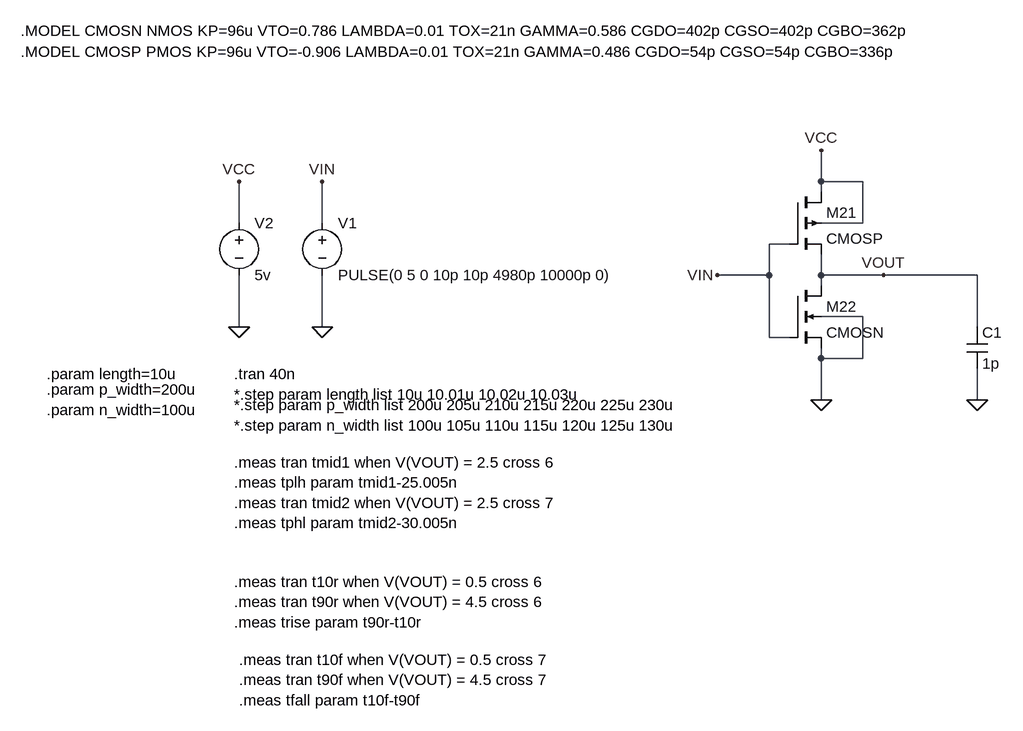
[diagram p0: schematic CMOS inverter with Overlap Capacitance.asc]
CMOS inverter with Overlap Capacitance.asc, the LTspice schematic file:
Version 4
SHEET 1 2240 1476
WIRE 688 96 688 48
WIRE 752 96 688 96
WIRE 688 112 688 96
WIRE -208 160 -208 96
WIRE -80 160 -80 96
WIRE 752 160 752 96
WIRE 752 160 688 160
WIRE 640 192 608 192
WIRE 608 240 608 192
WIRE 608 240 528 240
WIRE 688 240 688 208
WIRE 784 240 688 240
WIRE 928 240 784 240
WIRE 688 256 688 240
WIRE 752 304 688 304
WIRE -208 320 -208 240
WIRE -80 320 -80 240
WIRE 928 320 928 240
WIRE 608 336 608 240
WIRE 640 336 608 336
WIRE 688 368 688 352
WIRE 752 368 752 304
WIRE 752 368 688 368
WIRE 688 432 688 368
WIRE 928 432 928 384
FLAG -80 320 0
FLAG -80 96 VIN
FLAG -208 320 0
FLAG -208 96 VCC
FLAG 688 432 0
FLAG 688 48 VCC
FLAG 528 240 VIN
FLAG 784 240 VOUT
FLAG 928 432 0
SYMBOL voltage -80 144 R0
WINDOW 123 0 0 Left 0
WINDOW 39 0 0 Left 0
SYMATTR InstName V1
SYMATTR Value PULSE(0 5 0 10p 10p 4980p 10000p 0)
SYMBOL voltage -208 144 R0
WINDOW 123 0 0 Left 0
WINDOW 39 0 0 Left 0
SYMATTR InstName V2
SYMATTR Value 5v
SYMBOL pmos4 640 112 R0
SYMATTR InstName M21
SYMATTR Value CMOSP
SYMATTR Value2 l=length w=p_width
SYMBOL nmos4 640 256 R0
SYMATTR InstName M22
SYMATTR Value CMOSN
SYMATTR Value2 l=length w=n_width
SYMBOL cap 912 320 R0
SYMATTR InstName C1
SYMATTR Value 1p
TEXT -544 -136 Left 2 !.MODEL CMOSN NMOS KP=96u VTO=0.786 LAMBDA=0.01 TOX=21n GAMMA=0.586 CGDO=402p CGSO=402p CGBO=362p
TEXT -544 -104 Left 2 !.MODEL CMOSP PMOS KP=96u VTO=-0.906 LAMBDA=0.01 TOX=21n GAMMA=0.486 CGDO=54p CGSO=54p CGBO=336p
TEXT -216 392 Left 2 !.tran 40n
TEXT -216 424 Left 2 !*.step param length list 10u 10.01u 10.02u 10.03u
TEXT -504 392 Left 2 !.param length=10u
TEXT -216 528 Left 2 !.meas tran tmid1 when V(VOUT) = 2.5 cross 6\n.meas tplh param tmid1-25.005n\n.meas tran tmid2 when V(VOUT) = 2.5 cross 7\n.meas tphl param tmid2-30.005n
TEXT -216 712 Left 2 !.meas tran t10r when V(VOUT) = 0.5 cross 6\n.meas tran t90r when V(VOUT) = 4.5 cross 6\n.meas trise param t90r-t10r
TEXT -208 832 Left 2 !.meas tran t10f when V(VOUT) = 0.5 cross 7\n.meas tran t90f when V(VOUT) = 4.5 cross 7\n.meas tfall param t10f-t90f
TEXT -504 416 Left 2 !.param p_width=200u\n.param n_width=100u
TEXT -216 440 Left 2 !*.step param p_width list 200u 205u 210u 215u 220u 225u 230u\n*.step param n_width list 100u 105u 110u 115u 120u 125u 130u

The netlist it stands for:
* CMOS inverter with Overlap Capacitance.asc
V1 VIN 0 PULSE(0 5 0 10p 10p 4980p 10000p 0)
V2 VCC 0 5v
M21 VCC VIN VOUT VCC CMOSP l=length w=p_width
M22 VOUT VIN 0 0 CMOSN l=length w=n_width
C1 VOUT 0 1p
.model NMOS NMOS
.model PMOS PMOS
.lib standard.mos
.MODEL CMOSN NMOS KP=96u VTO=0.786 LAMBDA=0.01 TOX=21n GAMMA=0.586 CGDO=402p CGSO=402p CGBO=362p
.MODEL CMOSP PMOS KP=96u VTO=-0.906 LAMBDA=0.01 TOX=21n GAMMA=0.486 CGDO=54p CGSO=54p CGBO=336p
.tran 40n
*.step param length list 10u 10.01u 10.02u 10.03u
.param length=10u
.meas tran tmid1 when V(VOUT) = 2.5 cross 6
.meas tplh param tmid1-25.005n
.meas tran tmid2 when V(VOUT) = 2.5 cross 7
.meas tphl param tmid2-30.005n
.meas tran t10r when V(VOUT) = 0.5 cross 6
.meas tran t90r when V(VOUT) = 4.5 cross 6
.meas trise param t90r-t10r
.meas tran t10f when V(VOUT) = 0.5 cross 7
.meas tran t90f when V(VOUT) = 4.5 cross 7
.meas tfall param t10f-t90f
.param p_width=200u
.param n_width=100u
*.step param p_width list 200u 205u 210u 215u 220u 225u 230u
*.step param n_width list 100u 105u 110u 115u 120u 125u 130u
.backanno
.end